# EAGLE design adapter (EAGLE 6.2)
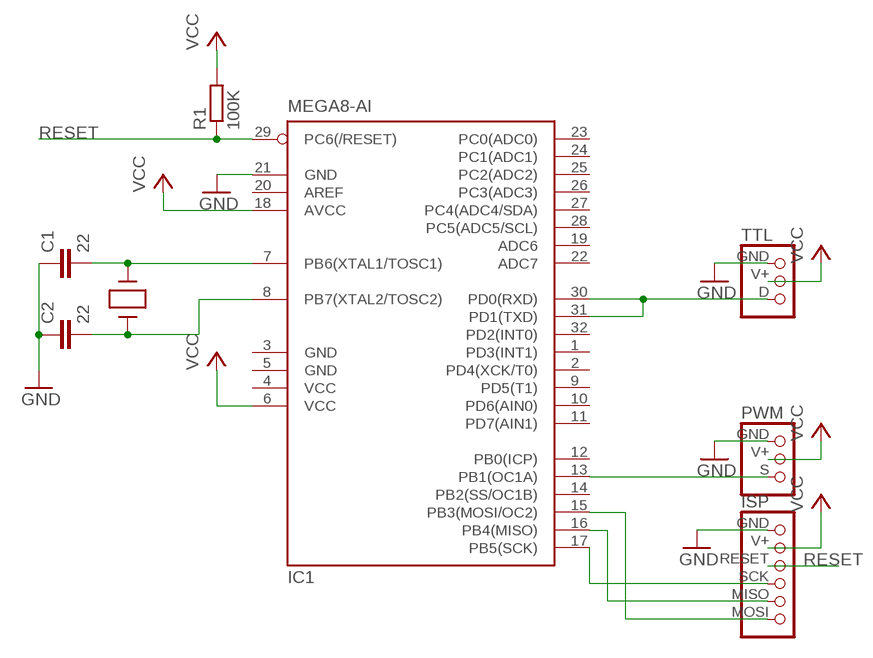
[diagram p0: schematic, sheet 1]

## Parts
C1  22  C_EU_22PF  [C0603]
C2  22  C_EU_22PF  [C0603]
IC1  MEGA8-AI  [TQFP32-08]
ISP  CONNEC_1X06_AVRISP  [CONNEC_AVRISP]
PWM  CONNEC_1X03_PWM  [CONNEC_PWM]
R1  100K  RESISTANCE-1MOHM  [R0805]
TTL  CONNEC_1X03_TTL  [CONNEC_TTL]
XTAL  QUARTZ  [HC49US]

## Nets
DATA: IC1.30(PD0(RXD)) IC1.31(PD1(TXD)) TTL.D
GND [alim]: C1.1 C2.1 IC1.21(GND) ISP.GND PWM.GND TTL.GND
MISO: IC1.16(PB4(MISO)) ISP.MISO
MOSI: IC1.15(PB3(MOSI/OC2)) ISP.MOSI
N$1: C1.2 IC1.7(PB6(XTAL1/TOSC1)) XTAL.2
N$2: C2.2 IC1.8(PB7(XTAL2/TOSC2)) XTAL.1
OC1A: IC1.13(PB1(OC1A)) PWM.S
RESET: IC1.29(PC6(/RESET)) ISP.RESET R1.1
SCK: IC1.17(PB5(SCK)) ISP.SCK
VCC [alim]: IC1.6(VCC) IC1.18(AVCC) ISP.V+ PWM.V+ R1.2 TTL.V+
Unconnected: IC1.1(PD3(INT1)) IC1.2(PD4(XCK/T0)) IC1.9(PD5(T1)) IC1.10(PD6(AIN0)) IC1.11(PD7(AIN1)) IC1.12(PB0(ICP)) IC1.14(PB2(SS/OC1B)) IC1.19(ADC6) IC1.20(AREF) IC1.22(ADC7) IC1.23(PC0(ADC0)) IC1.24(PC1(ADC1)) IC1.25(PC2(ADC2)) IC1.26(PC3(ADC3)) IC1.27(PC4(ADC4/SDA)) IC1.28(PC5(ADC5/SCL)) IC1.32(PD2(INT0))

## Power pins joined to a net without a drawn wire
GND: IC1.3(GND) IC1.5(GND)
VCC: IC1.4(VCC)

## Library data of the parts
C1 C2 = rhoban:C_EU: non polarised condo
IC1 = rhoban:MEGA8: MICROCONTROLLER 8 Kbytes FLASH, 1 kbytes SRAM, 512 bytes EEPROM, USART, 6-channel 10 bit ADC, 2-channel 8 bit ADC Pin compatible with Atmega48, ATMega88, ATMega168 Source: avr.lbr; MPN: ATMEGA8-16AU; OC_FARNELL: 9171371; OC_NEWARK: 73M8863
ISP = rhoban:CONNEC_1X06
PWM TTL = rhoban:CONNEC_1X03
R1 = rhoban:RESISTANCE: RESISTOR, European symbol; DATASHEET: panasonic_resistance.pdf; FARNELL_LINK: http://fr.farnell.com/panasonic/era6aeb105v/resistance-0805-0-1-0-125w/dp/1577699
XTAL = rhoban:QUARTZ

## Net classes
1 alim: width 0.508 mm, clearance 0.076 mm

## Board
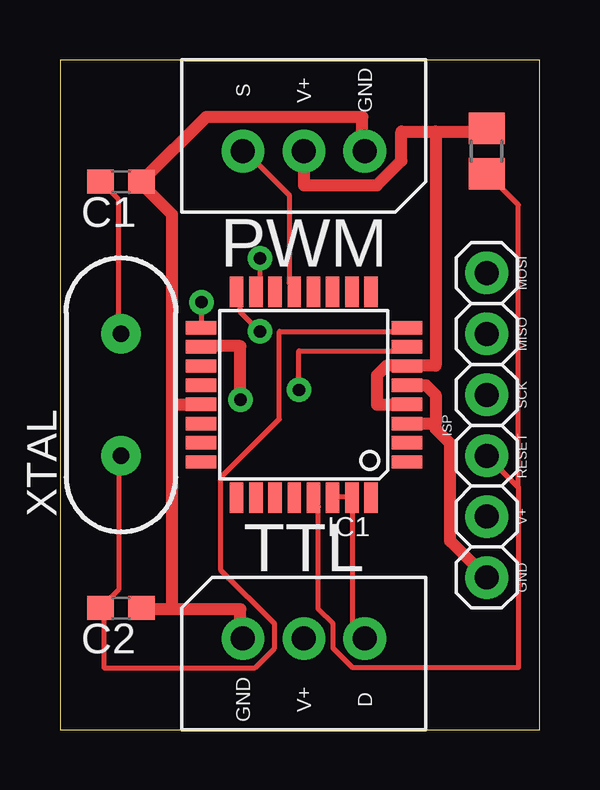
[diagram p1: board, top side]
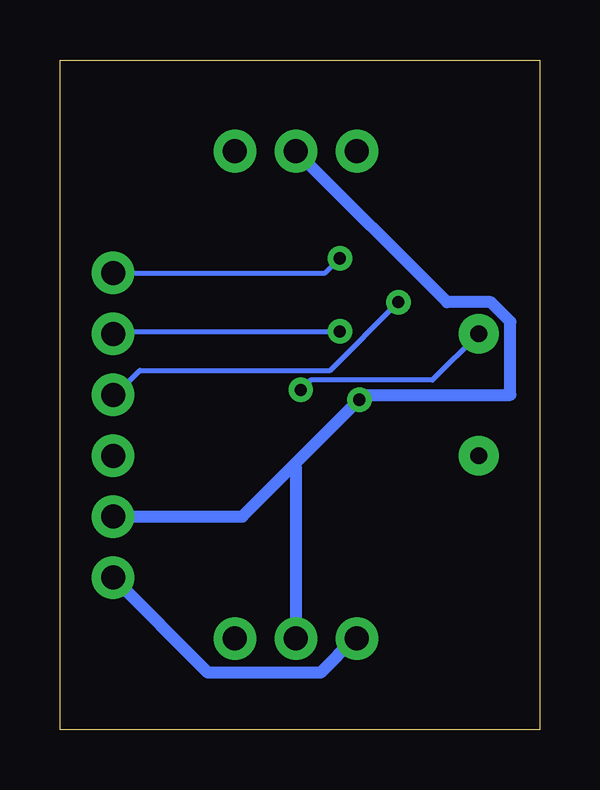
[diagram p2: board, bottom side, seen from below]

Size 19.99 x 27.93 mm. Coordinates in mm from the lower left corner, seen from the top.
Outline: 0,0 19.99,0 19.99,27.93 0,27.93 0,0
Copper layers (1*16): Top 0.035mm / dielectric 1.5mm / Bottom 0.035mm
Design rules: minimum track width 8mil, minimum drill 20mil, track to track 8mil, track to pad 8mil, pad to pad 8mil, via to via 8mil, smd to smd 8mil, copper to edge 10mil, drill to drill 8mil, minimum pad ring 12mil, minimum via ring 10mil, stop-mask expansion 4mil, vias tented up to drill 25mil, thermal gap 10mil

### Footprints (pad centres in the part's own frame; a part is rotated, then mirrored left to right if it is on the bottom)
C0603 = smd 1.1 x 1: 1 -0.85,0; 2 0.85,0
TQFP32-08 = smd 1.27 x 0.559: 1 -4.293,2.8; 2 -4.293,2; 3 -4.293,1.2; 4 -4.293,0.4; 5 -4.293,-0.4; 6 -4.293,-1.2; 7 -4.293,-2; 8 -4.293,-2.8; 17 4.293,-2.8; 18 4.293,-2; 19 4.293,-1.2; 20 4.293,-0.4; 21 4.293,0.4; 22 4.293,1.2; 23 4.293,2; 24 4.293,2.8 | smd 0.559 x 1.27: 9 -2.8,-4.293; 10 -2,-4.293; 11 -1.2,-4.293; 12 -0.4,-4.293; 13 0.4,-4.293; 14 1.2,-4.293; 15 2,-4.293; 16 2.8,-4.293; 25 2.8,4.293; 26 2,4.293; 27 1.2,4.293; 28 0.4,4.293; 29 -0.4,4.293; 30 -1.2,4.293; 31 -2,4.293; 32 -2.8,4.293
CONNEC_AVRISP = drill 1 pad 1.778: GND -6.35,0; MISO 3.81,0; MOSI 6.35,0; RESET -1.27,0; SCK 1.27,0; V+ -3.81,0
CONNEC_PWM = drill 1 pad 1.778: GND -2.54,1.27; S 2.54,1.27; V+ 0,1.27
R0805 = smd 1.3 x 1.5: 1 -0.95,0; 2 0.95,0
CONNEC_TTL = drill 1 pad 1.778: D 7.62,3.81; GND 2.54,3.81; V+ 5.08,3.81
HC49US = drill 0.7 pad 1.651: 1 -2.54,0; 2 2.54,0

### Placement (x,y rotation side)
C1  2.54,22.86 180 top
C2  2.54,5.08 180 top
IC1  10.16,13.97 180 top
ISP  17.78,12.7 90 top
PWM  10.16,25.4 180 top
R1  17.78,24.13 90 top
TTL  5.08,0 0 top
XTAL  2.54,13.97 90 top

### Tracks (layer width: path | path; a pad name or v marks a point on that pad's centre or on a via)
DATA
  Top 0.203: IC1.30 11.38,9.7 11.99,9.7 IC1.31 12.19,9.5 12.19,4.22 12.6,3.81 TTL.D
GND
  Top 0.508: 15.65,12.75 14.63,12.75 IC1.3 | 15.65,12.75 15.65,13.97 15.24,14.38 14.63,14.38 IC1.5 | ISP.GND 16.26,7.87 16.26,11.94 15.65,12.55 15.65,12.75 | PWM.GND 12.6,24.13 12.6,25.55 6.1,25.55 3.45,22.91 C1.1 3.45,22.71 4.67,21.49 4.67,13.56 | 4.67,5.03 7.52,5.03 7.52,3.81 TTL.GND | 4.67,5.03 3.45,5.03 C2.1 | 4.67,13.56 5.69,13.56 IC1.21 | 4.67,5.03 4.67,13.56
  Bottom 0.508: ISP.GND 13.82,2.39 9.14,2.39 7.72,3.81 TTL.GND
MISO  (via drill 0.51)
  Top 0.203: v8.33,16.61 7.52,17.42 7.52,18.24 IC1.16
  Bottom 0.203: v8.33,16.61 17.68,16.61 ISP.MISO
MOSI  (via drill 0.51)
  Top 0.203: v8.33,19.66 8.33,18.44 IC1.15
  Bottom 0.203: v8.33,19.66 8.94,19.05 ISP.MOSI
N$1  (via drill 0.51)
  Top 0.203: C1.2 1.83,22.71 2.44,22.1 2.44,16.61 XTAL.2 | v9.96,14.17 9.96,15.8 14.43,15.8 IC1.7
  Bottom 0.203: v9.96,14.17 9.55,14.58 4.47,14.58 XTAL.2
N$2
  Top 0.203: XTAL.1 2.44,11.33 2.44,5.84 1.83,5.23 C2.2 1.83,5.03 1.83,2.59 8.13,2.59 8.94,3.4 8.94,4.42 6.71,6.66 6.71,10.52 9.14,12.95 9.14,16.61 14.43,16.61 IC1.8
OC1A
  Top 0.203: IC1.13 9.75,18.44 9.55,18.64 9.55,22.3 7.72,24.13 PWM.S
RESET
  Top 0.203: 19.1,10.11 19.1,2.59 12.19,2.59 11.38,3.4 11.38,4.42 10.77,5.03 10.77,9.3 10.57,9.5 IC1.29 | ISP.RESET 19.1,10.11 | 19.1,10.11 19.1,21.9 17.88,23.11 R1.1
SCK  (via drill 0.51)
  Top 0.203: v5.89,17.83 5.89,16.82 IC1.17
  Bottom 0.203: v5.89,17.83 8.74,14.99 16.66,14.99 17.68,13.97 ISP.SCK
VCC  (via drill 0.51)
  Top 0.508: IC1.4 14.43,13.56 13.21,13.56 13.21,14.78 13.61,15.19 14.43,15.19 IC1.6 | 14.63,15.19 IC1.6 | 15.65,24.94 14.22,24.94 14.22,23.72 13.21,22.71 10.16,22.71 PWM.V+ | 15.65,24.94 17.68,24.94 R1.2 | 15.65,24.94 15.65,15.19 14.83,15.19 IC1.6 | v7.52,13.77 7.52,16 5.89,16 IC1.18
  Bottom 0.508: 10.26,11.02 12.39,8.89 ISP.V+ | 10.26,11.02 v7.52,13.77 7.52,13.97 1.22,13.97 1.22,17.02 2.03,17.83 3.86,17.83 PWM.V+ | TTL.V+ 10.16,10.92 10.26,11.02